# EAGLE schematic VIVA_PIC16_REV4-5 (EAGLE 6.3)

## Sheet 1 of 3
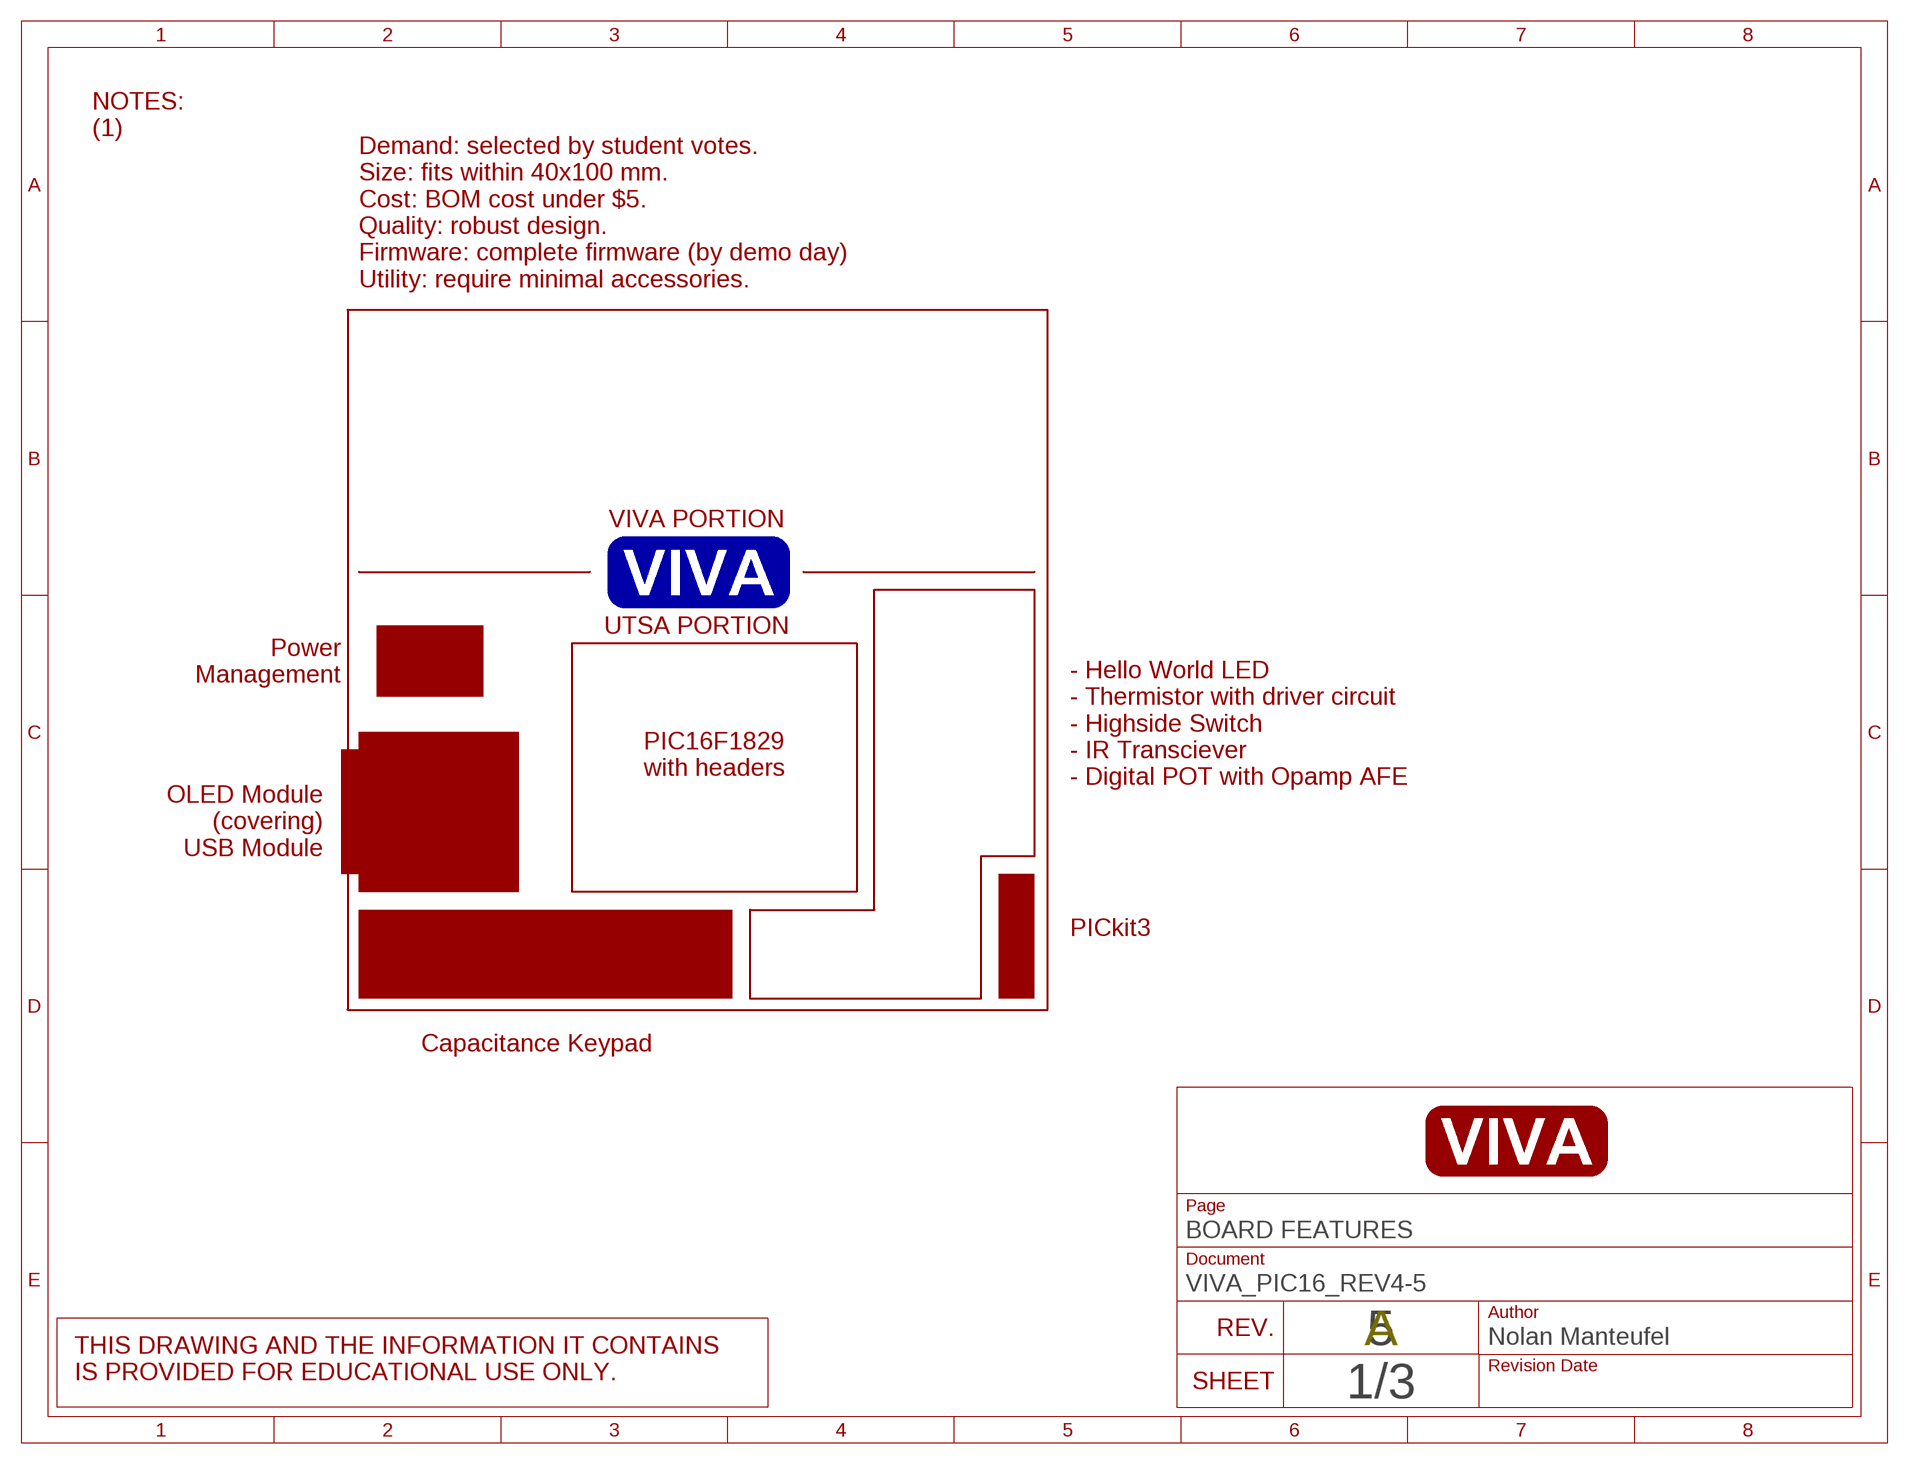
[diagram p0: schematic, sheet 1]

### Parts
U$1  VIVA_LOGO  [VIVA_LOGO]

### Notes on the sheet
- NOTES:
  (1)
- Demand: selected by student votes.
  Size: fits within 40x100 mm.
  Cost: BOM cost under $5.
  Quality: robust design.
  Firmware: complete firmware (by demo day)
  Utility: require minimal accessories.
- VIVA PORTION
- UTSA PORTION
- Power
  Management
- - Hello World LED
  - Thermistor with driver circuit
  - Highside Switch
  - IR Transciever
  - Digital POT with Opamp AFE
- PIC16F1829
  with headers
- OLED Module
  (covering)
  USB Module
- PICkit3
- Capacitance Keypad
- 5

## Sheet 2 of 3
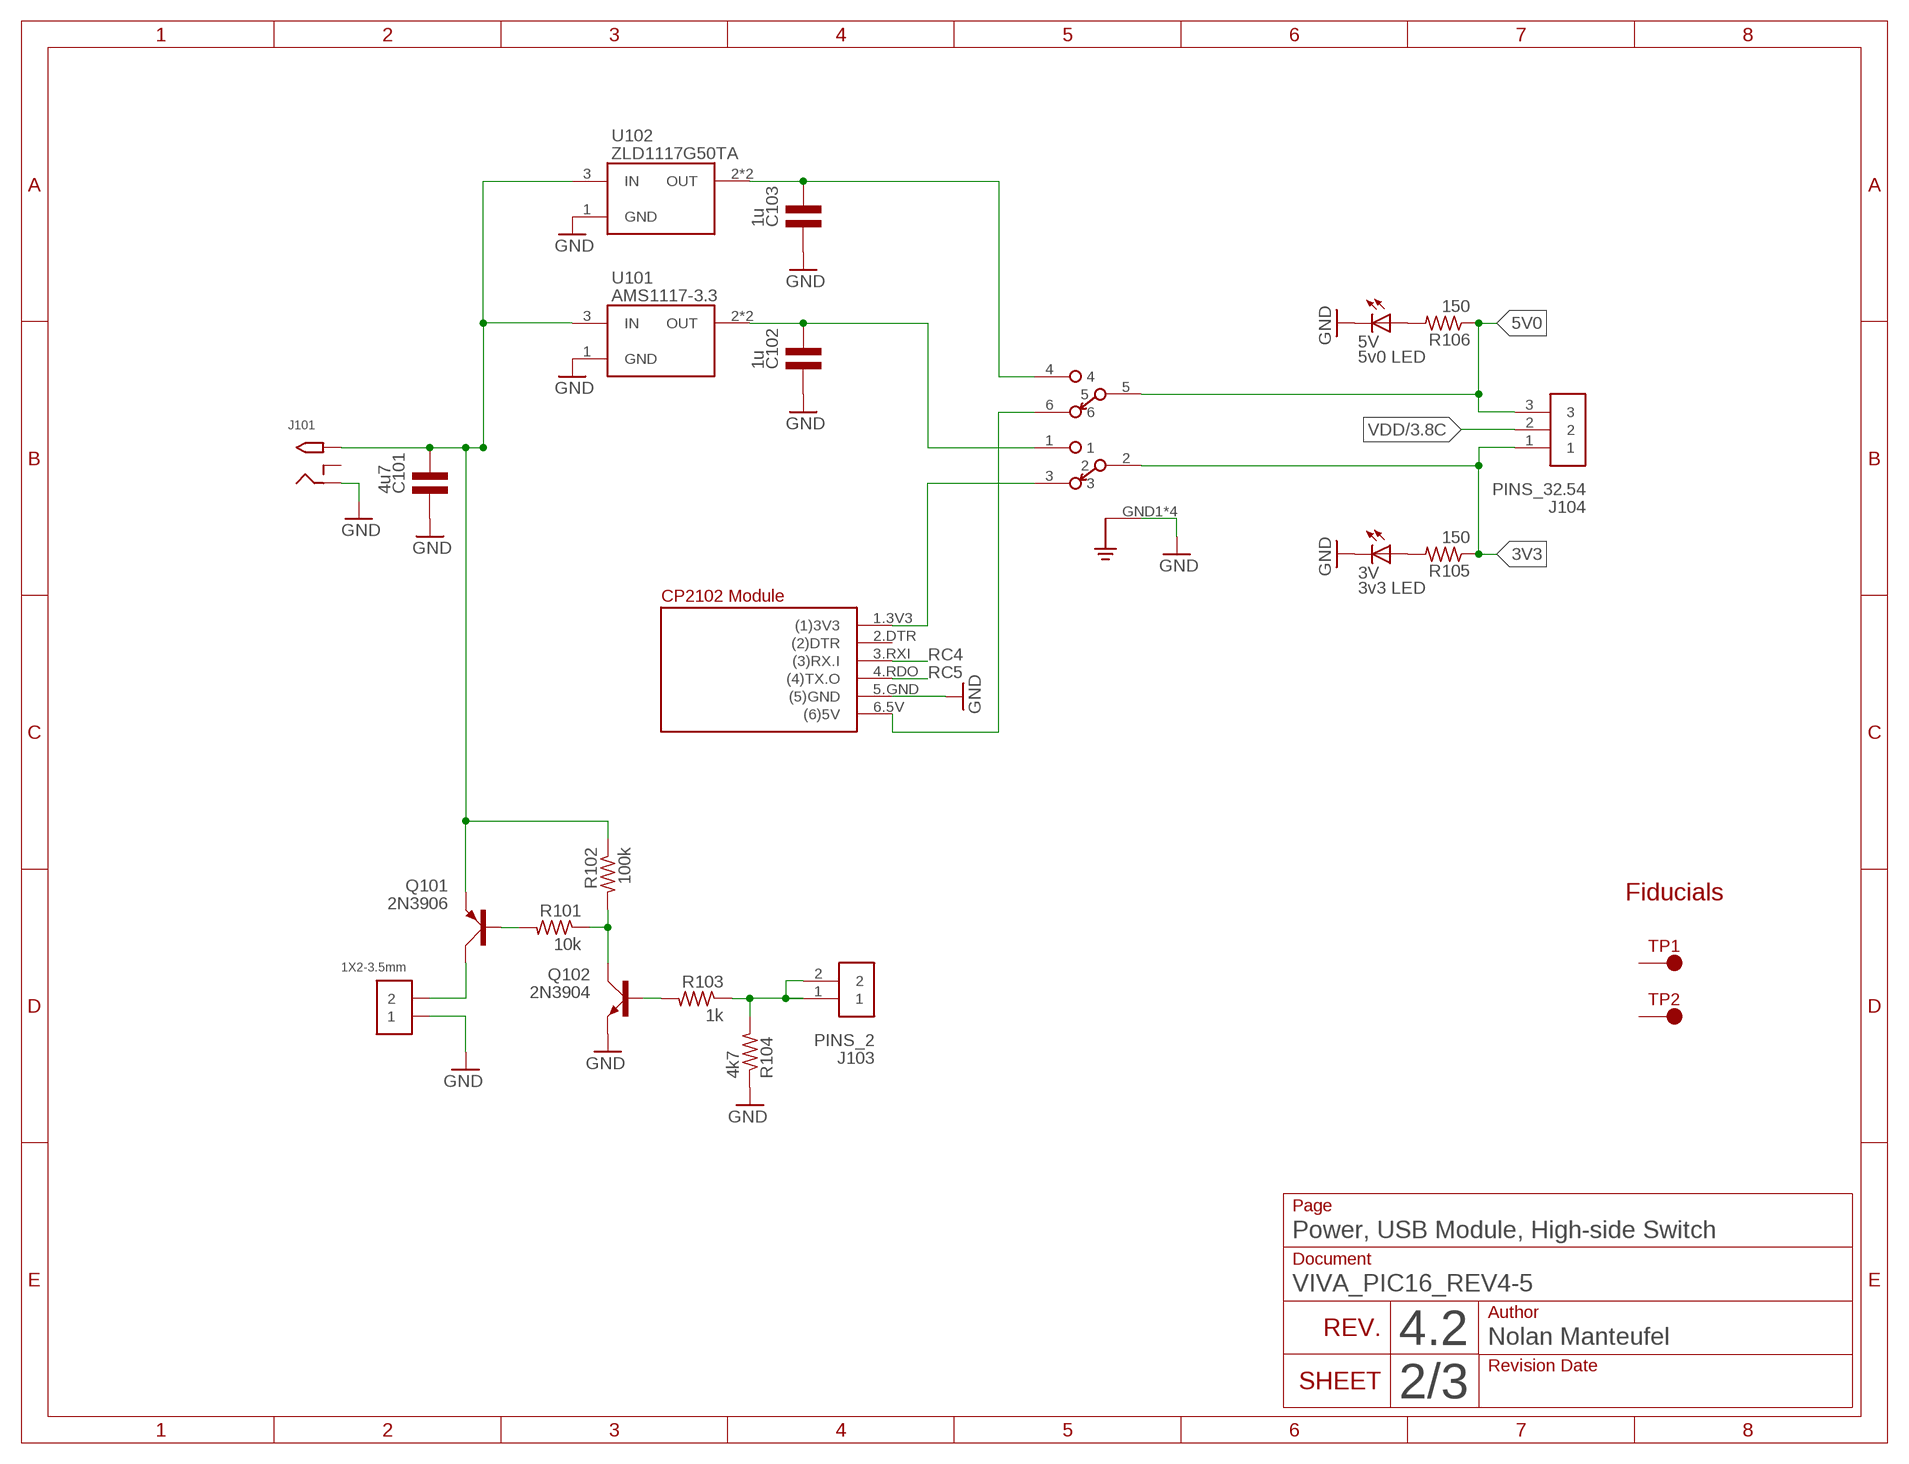
[diagram p1: schematic, sheet 2]

### Parts
3V  3v3 LED  LEDCHIPLED_0805  [CHIPLED_0805]
5V  5v0 LED  LEDCHIPLED_0805  [CHIPLED_0805]
C101  4u7  C0805  [C0805]
C102  1u  C0805  [C0805]
C103  1u  C0805  [C0805]
J101  2.1MMJACKTHM  [PJ-102A]
J102  1X2-3.5MM-3.5MM  [1X2-3.5MM]
J103  PINS_2  [PINS_2]
J104  PINS_32.54  [PINS_3]
M101  VIVA_USB-TTL  [VIVA_USB_TTL_SUBTEXT]
Q101  2N3906  2N3906SOT23  [SOT23]
Q102  2N3904  2N3904SOT23  [SOT23]
R101  10k  R-US_R0805  [R0805]
R102  100k  R-US_R0805  [R0805]
R103  1k  R-US_R0805  [R0805]
R104  4k7  R-US_R0805  [R0805]
R105  150  R-US_R0805  [R0805]
R106  150  R-US_R0805  [R0805]
S101  SWITCH_OS202013  [OS202013MT5QN1]
TP1  TESTPOINTFIDUCIAL  [FIDUCIAL]
TP2  TESTPOINTFIDUCIAL  [FIDUCIAL]
U101  AMS1117-3.3  REGULATOR_SCHLM1117  [SOT223]
U102  ZLD1117G50TA  REGULATOR_SCHLM1117  [SOT223]

### Nets
3V3: J104.1 R105.1 S101.2
5V0: J104.3 R106.1 S101.5
GND: 3V.C 5V.C C101.1 C102.1 C103.1 J101.RING J102.1 M101.5.GND((5)GND) Q102.2(E) R104.1 S101.GND1(GND) S101.GND2(GND) S101.GND3(GND) S101.GND4(GND) U101.1(GND) U102.1(GND) ; also sheet 3
N$1: J103.1 J103.2 R103.1 R104.2
N$2: 5V.A R106.2
N$5: Q101.1(B) R101.2
N$8: Q102.3(C) R101.1 R102.2
N$10: Q102.1(B) R103.2
N$14: M101.1.3V3((1)3V3) S101.3
N$15: J102.2 Q101.3(C)
N$16: M101.6.5V((6)5V) S101.6
N$17: C103.2 S101.4 U102.2(OUT) U102.4.TAB(OUT)
N$18: C102.2 S101.1 U101.2(OUT) U101.4.TAB(OUT)
N$21: 3V.A R105.2
RC4: M101.3.RXI((3)RX.I) ; also sheet 3
RC5: M101.4.RDO((4)TX.O) ; also sheet 3
VDC: C101.2 J101.TIP Q101.2(E) R102.1 U101.3(IN) U102.3(IN)
VDD: J104.2 ; also sheet 3
Unconnected: J101.RING_SW M101.2.DTR((2)DTR) TP1.FIDUCIAL TP2.FIDUCIAL

### Notes on the sheet
- Fiducials
- Page
- Power, USB Module, High-side Switch
- Document
- REV. | Author
- 4.2 | Nolan Manteufel
- SHEET | Revision Date

## Sheet 3 of 3
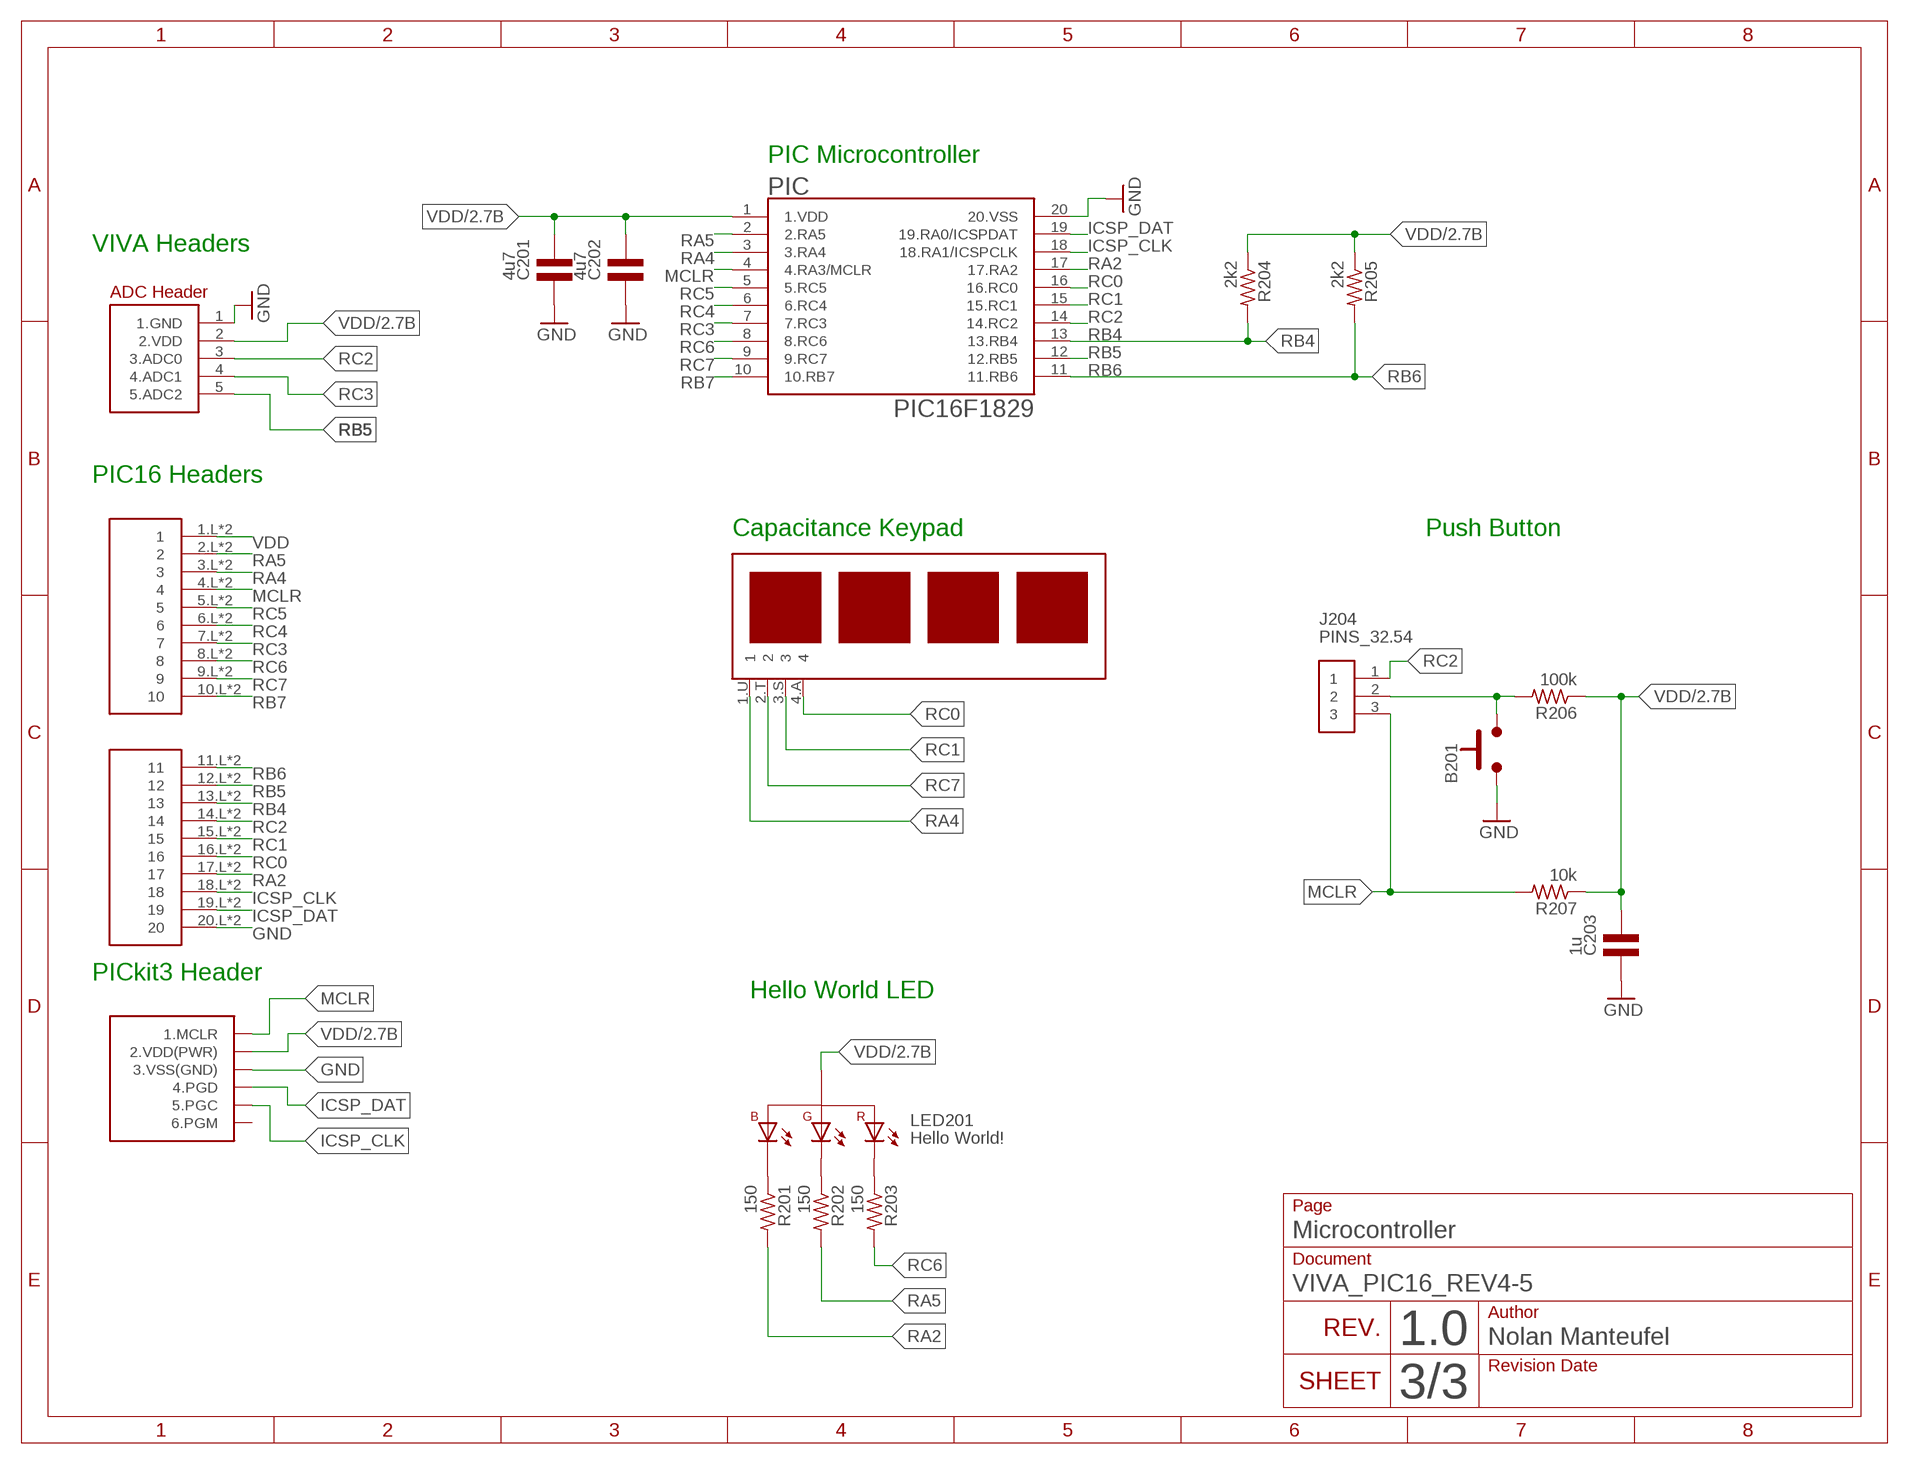
[diagram p2: schematic, sheet 3]

### Parts
B201  PUSHBUTTON6X6MM  [6X6MM]
C201  4u7  C0805  [C0805]
C202  4u7  C0805  [C0805]
C203  1u  C0805  [C0805]
J201  VIVA_PIC16  [VIVA_PIC16]
J202  VIVA-HEADER-ADCNONAME  [VIVA-HEADER-ADC-NONAME]
J203  PICKIT3  [PICKIT3]
J204  PINS_32.54  [PINS_3]
LED201  Hello World!  RGB_LED  [LED_RGB-5050]
PIC  PIC16F1829  [SOP20-NEW]
R201  150  R-US_R0805  [R0805]
R202  150  R-US_R0805  [R0805]
R203  150  R-US_R0805  [R0805]
R204  2k2  R-US_R0805  [R0805]
R205  2k2  R-US_R0805  [R0805]
R206  100k  R-US_R0805  [R0805]
R207  10k  R-US_R0805  [R0805]
U$201  VIVA_UTSA-KEYPAD  [VIVA_UTSA-KEYPAD]

### Nets
GND: B201.1.A B201.2.A C201.1 C202.1 C203.1 J201.20.L J201.20.R J202.1(1.GND) J203.3(3.VSS(GND)) PIC.20(20.VSS) ; also sheet 2
ICSP_CLK: J201.18.L J201.18.R J203.5(5.PGC) PIC.18(18.RA1/ICSPCLK)
ICSP_DAT: J201.19.L J201.19.R J203.4(4.PGD) PIC.19(19.RA0/ICSPDAT)
MCLR: J201.4.L J201.4.R J203.1(1.MCLR) J204.3 PIC.4(4.RA3/MCLR) R207.2
N$7: B201.3.B B201.4.B J204.2 R206.2
N$11: LED201.4.B- R201.1
N$12: LED201.2.G- R202.1
N$13: LED201.1.R- R203.1
RA2: J201.17.L J201.17.R PIC.17(17.RA2) R201.2
RA4: J201.3.L J201.3.R PIC.3(3.RA4) U$201.1.U
RA5: J201.2.L J201.2.R PIC.2(2.RA5) R202.2
RB4: J201.13.L J201.13.R PIC.13(13.RB4) R204.2
RB5: J201.12.L J201.12.R J202.5(5.ADC2) PIC.12(12.RB5)
RB6: J201.11.L J201.11.R PIC.11(11.RB6) R205.2
RB7: J201.10.L J201.10.R PIC.10(10.RB7)
RC0: J201.16.L J201.16.R PIC.16(16.RC0) U$201.4.A
RC1: J201.15.L J201.15.R PIC.15(15.RC1) U$201.3.S
RC2: J201.14.L J201.14.R J202.3(3.ADC0) J204.1 PIC.14(14.RC2)
RC3: J201.7.L J201.7.R J202.4(4.ADC1) PIC.7(7.RC3)
RC4: J201.6.L J201.6.R PIC.6(6.RC4) ; also sheet 2
RC5: J201.5.L J201.5.R PIC.5(5.RC5) ; also sheet 2
RC6: J201.8.L J201.8.R PIC.8(8.RC6) R203.2
RC7: J201.9.L J201.9.R PIC.9(9.RC7) U$201.2.T
VDD: C201.2 C202.2 C203.2 J201.1.L J201.1.R J202.2(2.VDD) J203.2(2.VDD(PWR)) LED201.3.+ PIC.1(1.VDD) R204.1 R205.1 R206.1 R207.1 ; also sheet 2
Unconnected: J203.6(6.PGM)

### Notes on the sheet
- PIC Microcontroller
- VIVA Headers
- PIC16 Headers
- Capacitance Keypad | Push Button
- PICkit3 Header
- Hello World LED
- Page
- Microcontroller
- Document
- REV. | Author
- 1.0 | Nolan Manteufel
- SHEET | Revision Date

## Library data of the parts
3V 5V = adafruit:LED: LED OSRAM: - CHIPLED LG R971, LG N971, LY N971, LG Q971, LY Q971, LO R971, LY R971 LH N974, LH R974 LS Q976, LO Q976, LY Q976 LO Q996 - Hyper CHIPLED LW Q18S LB Q993, LB Q99A, LB R99A - SideLED LS A670, LO A670, LY A670, LG A670, LP A670 LB A673, LV A673, LT A673, LW A673 LH A674 LY A675 LS A676, LA A676, LO A676, LY A676, LW A676 LS A679, LY A679, LG A679 - Hyper Micro SIDELED® LS Y876, LA Y876, LO Y876, LY Y876 LT Y87S - SmartLED LW L88C, LW L88S LB L89C, LB L89S, LG L890 LS L89K, LO L89K, LY L89K LS L896, LA L896, LO L896, LY L896 - TOPLED LS T670, LO T670, LY T670, LG T670, LP T670 LSG T670, LSP T670, LSY T670, LOP T670, LYG T670 LG T671, LOG T671, LSG T671 LB T673, LV T673, LT T673, LW T673 LH T674 LS T676, LA T676, LO T676, LY T676, LB T676, LH T676, LSB T676, LW T676 LB T67C, LV T67C, LT T67C, LS T67K, LO T67K, LY T67K, LW E67C LS E67B, LA E67B, LO E67B, LY E67B, LB E67C, LV E67C, LT E67C LW T67C LS T679, LY T679, LG T679 LS T770, LO T770, LY T770, LG T770, LP T770 LB T773, LV T773, LT T773, LW T773 LH T774 LS E675, LA E675, LY E675, LS T675 LS T776, LA T776, LO T776, LY T776, LB T776 LHGB T686 LT T68C, LB T68C - Hyper Mini TOPLED® LB M676 - Mini TOPLED Santana® LG M470 LS M47K, LO M47K, LY M47K Source: http://www.osram.convergy.de/
B201 = nolan-utsa:PUSHBUTTON: Tactile push button switch
C101-C103 C201-C203 = nolan-utsa:C
J101 = nolan-utsa:2.1MMJACK: 2.1mm x 5.5mm THM DC jack with internal switch. Digikey part #PJ-102A, 4UCON part #05537 2.1mm x 5.5mm SMT DC jack with internal switch. Digikey part #PJ-002A-SMT, 4UCON part #03267 By microbuilder.eu & adafruit.com
J102 = nolan-utsa:1X2-3.5MM: 3.5mm Terminal block http://www.ladyada.net/library/pcb/eaglelibrary.html
J103 = nolan-utsa:PINS_2
J104 J204 = nolan-utsa:PINS_3
J201 = nolan-viva:VIVA_PIC16
J202 = nolan-utsa:VIVA-HEADER-ADC
J203 = nolan-viva:PICKIT3
LED201 = nolan-utsa:RGB_LED
M101 = nolan-utsa:VIVA_USB-TTL
PIC = nolan-utsa:PIC16F1829
Q101 = nolan-utsa:2N3906: PNP TRANSISTOR
Q102 = nolan-utsa:2N3904: NPN TRANSISTOR
R101-R106 R201-R207 = adafruit:R-US_: RESISTOR, American symbol
S101 = nolan-utsa:SWITCH_OS202013
TP1 TP2 = nolan-utsa:TESTPOINT
U101 U102 = nolan-utsa:REGULATOR_SCH: Linear Regulator in SOT-223 package. NOTE: select correct pinout for your application. Tab may be OUT or GND!
U$1 = nolan-utsa:VIVA_LOGO
U$201 = nolan-utsa:VIVA_UTSA-KEYPAD